# Altium schematic sheet FINAL VERSION.SchDoc
size A4
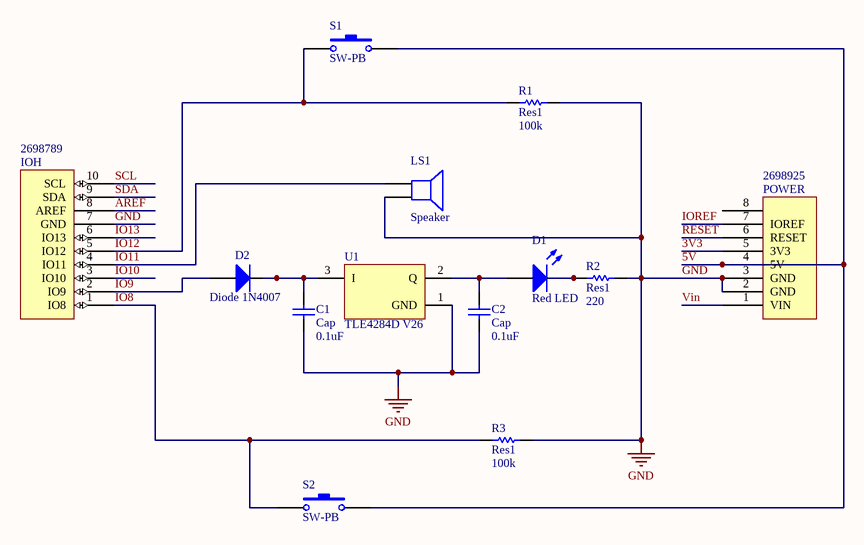
[diagram p0: FINAL VERSION.SchDoc]

## Parts
C1  Cap  value 0.1uF  [RAD-0.3]
C2  Cap  value 0.1uF  [RAD-0.3]
D1  Red LED  [3.2X1.6X1.1]
D2  Diode 1N4007  [DO-41]
IOH  Supplier Part Number 3: 2698789  [Header 10x1 8.5mm]  (hidden comment: IOH)
LS1  Speaker  [PIN2]
POWER  Supplier Part Number 4: 2698925  [Header 8x1 8.5mm]  (hidden comment: POWER_UNO)
R1  Res1  value 100k  [AXIAL-0.3]
R2  Res1  value 220  [AXIAL-0.3]
R3  Res1  value 100k  [AXIAL-0.3]
S1  SW-PB  [SPST-2]
S2  SW-PB  [SPST-2]
U1  TLE4284D V26  [INF-PG-TO252-3-11_N]

## Nets
GND: C1.1 C2.1 IOH.7(GND) LS1.2 POWER.2(GND) POWER.3(GND) R1.2 R2.2 R3.2 U1.1(GND)
3V3: POWER.5(3V3)
5V: POWER.4(5V) S1.2 S2.2
AREF: IOH.8(AREF)
IO8: IOH.1(IO8) R3.1 S2.1
IO9: D2.1(A) IOH.2(IO9)
IO10: IOH.3(IO10)
IO11: IOH.4(IO11) LS1.1
IO12: IOH.5(IO12) R1.1 S1.1
IO13: IOH.6(IO13)
IOREF: POWER.7(IOREF)
RESET: POWER.6(RESET)
SCL: IOH.10(SCL)
SDA: IOH.9(SDA)
Vin: POWER.1(VIN)
NetC1_2: C1.2 D2.2(K) U1.3(I)
NetC2_2: C2.2 D1.1(A) U1.2(Q)
NetD1_2: D1.2(K) R2.1

Not connected (* = marked no-connect by the designer): POWER 8

## Library data of the parts
C1 C2 = Cap: Capacitor; Published: 8-Jun-2000; LatestRevisionDate: 17-Jul-2002; LatestRevisionNote: Re-released for DXP Platform.; PackageReference: RAD-0.3; Publisher: Altium Limited; PackageDescription: Radial Cap, Thru-Hole; 2 Leads; 0.3 in Pin Spacing
D1 = LED2: Typical RED, GREEN, YELLOW, AMBER GaAs LED; Published: 8-Jun-2000; LatestRevisionDate: 17-Jul-2002; LatestRevisionNote: Re-released for DXP Platform.; PackageVersion: Feb-2002; PackageReference: 3.2X1.6X1.1; Publisher: Altium Limited; PackageDescription: SM LED; 2 Flat Leads
D2 = Diode 1N4007: 1 Amp General Purpose Rectifier; Published: 8-Jun-2000; LatestRevisionDate: 17-Jul-2002; LatestRevisionNote: Re-released for DXP Platform.; DatasheetVersion: 1998; PackageVersion: Aug-1999; PackageReference: DO-41; Publisher: Altium Limited; PackageDescription: Diode, Axial; Body 5.2 x 2.7 mm (LxDia. max), Lead Dia. 0.86 mm (max); Code_JEDEC: DO-204-AL; ComponentLink1Description: Manufacturer Link; ComponentLink1URL: http://www.fairchildsemi.com/; ComponentLink2Description: Datasheet; ComponentLink2URL: http://www.fairchildsemi.com/ds/1N%2F1N4001.pdf
LS1 = Speaker: Loudspeaker; Published: 24-Mar-1999; LatestRevisionDate: 17-Jul-2002; LatestRevisionNote: Re-released for DXP Platform.; PackageReference: PIN2; Publisher: Altium Limited
R1-R3 = Res1: Resistor; Published: 8-Jun-2000; LatestRevisionDate: 17-Jul-2002; LatestRevisionNote: Re-released for DXP Platform.; PackageReference: AXIAL-0.3; Publisher: Altium Limited; PackageDescription: Axial Device, Thru-Hole; 2 Leads; 0.3 in Pin Spacing
S1 S2 = SW-PB: Switch; Published: 24-Mar-1999; LatestRevisionDate: 17-Jul-2002; LatestRevisionNote: Re-released for DXP Platform.; PackageReference: SPST-2; Publisher: Altium Limited; PackageDescription: Switch; 2 Leads
U1 = TLE4284D V26: Voltage Regulator, 4 to 40 V Supply, 2.6 V Output, -40 to 150 degC, PG-TO252-3-11, Reel, Green; Manufacturer: Infineon; Accuracy: 3 %; Dropout Voltage: 1300 mV; Green: TRUE; Max. Output Current: 1000 mA; Operating Range: 4 to 40 V; Output Voltage: 2.6V; Regulator Type: single output; Typical Quiescent Current: 800 uA; DatasheetVersion: Rev. 2.1; PackageVersion: Dec-06; PackageReference: PG-TO252-3-11; PackageDescription: 3-Pin Plastic (Green) Transistor Single Outline Package, 6.5 x 6.12 mm Body, 2.28 mm Pitch; Supplier 1: Mouser; Supplier Part Number 1: 726-TLE4284DV26; Supplier 2: Digi-Key; Supplier Part Number 2: TLE4284D V26INTR-ND; Supplier 3: Digi-Key; Supplier Part Number 3: TLE4284D V26INCT-ND; Supplier 4: Digi-Key; Supplier Part Number 4: TLE4284D V26INDKR-ND; Halogen-free: TRUE; Packing: Reel; Mounting Technology: Surface Mount; PartNumber: TLE4284D V26; ComponentLink1Description: Manufacturer URL; ComponentLink1URL: http://www.infineon.com/; ComponentLink2Description: Datasheet; ComponentLink2URL: http://www.infineon.com/dgdl/TLE4284_DS_21.pdf?folderId=db3a304318f3fe290118f5a433570040&fileId=db3a30431c48a312011c51ca22f501de&location=en.Products.Automotive_ICs.Linear_Voltage_Regulators_for_Automotive-Applications.Linear_Voltage_Regulators_-_Selection_Table.DATASHEET.TLE4284_DS_21.pdf; ComponentLink3Description: Package Specification; ComponentLink3URL: http://www.infineon.com/dgdl/BTS142_DS_13.pdf?folderId=db3a3043163797a6011667aa084c0e01&fileId=db3a3043163797a6011667ac98be0e02&location=en.Products.Automotive_ICs.Smart_High-_and_Low-Side_Switches.HITFET___TEMPFET__-_Smart_Low-Side_Switches.DATASHEET.BTS142_DS_13.pdf
IOH = IOH: Supplier 1: Arrow; Supplier Part Number 1: 2698803S4475693N1004; Supplier 2: Digi-Key; Supplier Part Number 2: SAM1198-10-ND; Supplier 3: Arrow
POWER = POWER_UNO: Supplier 1: Digi-Key; Supplier Part Number 1: SAM1198-08-ND; Supplier 2: Arrow; Supplier Part Number 2: 2698939; Supplier 3: Arrow; Supplier Part Number 3: 2698940; Supplier 4: Arrow